# EAGLE design sch (EAGLE 7.3.0)
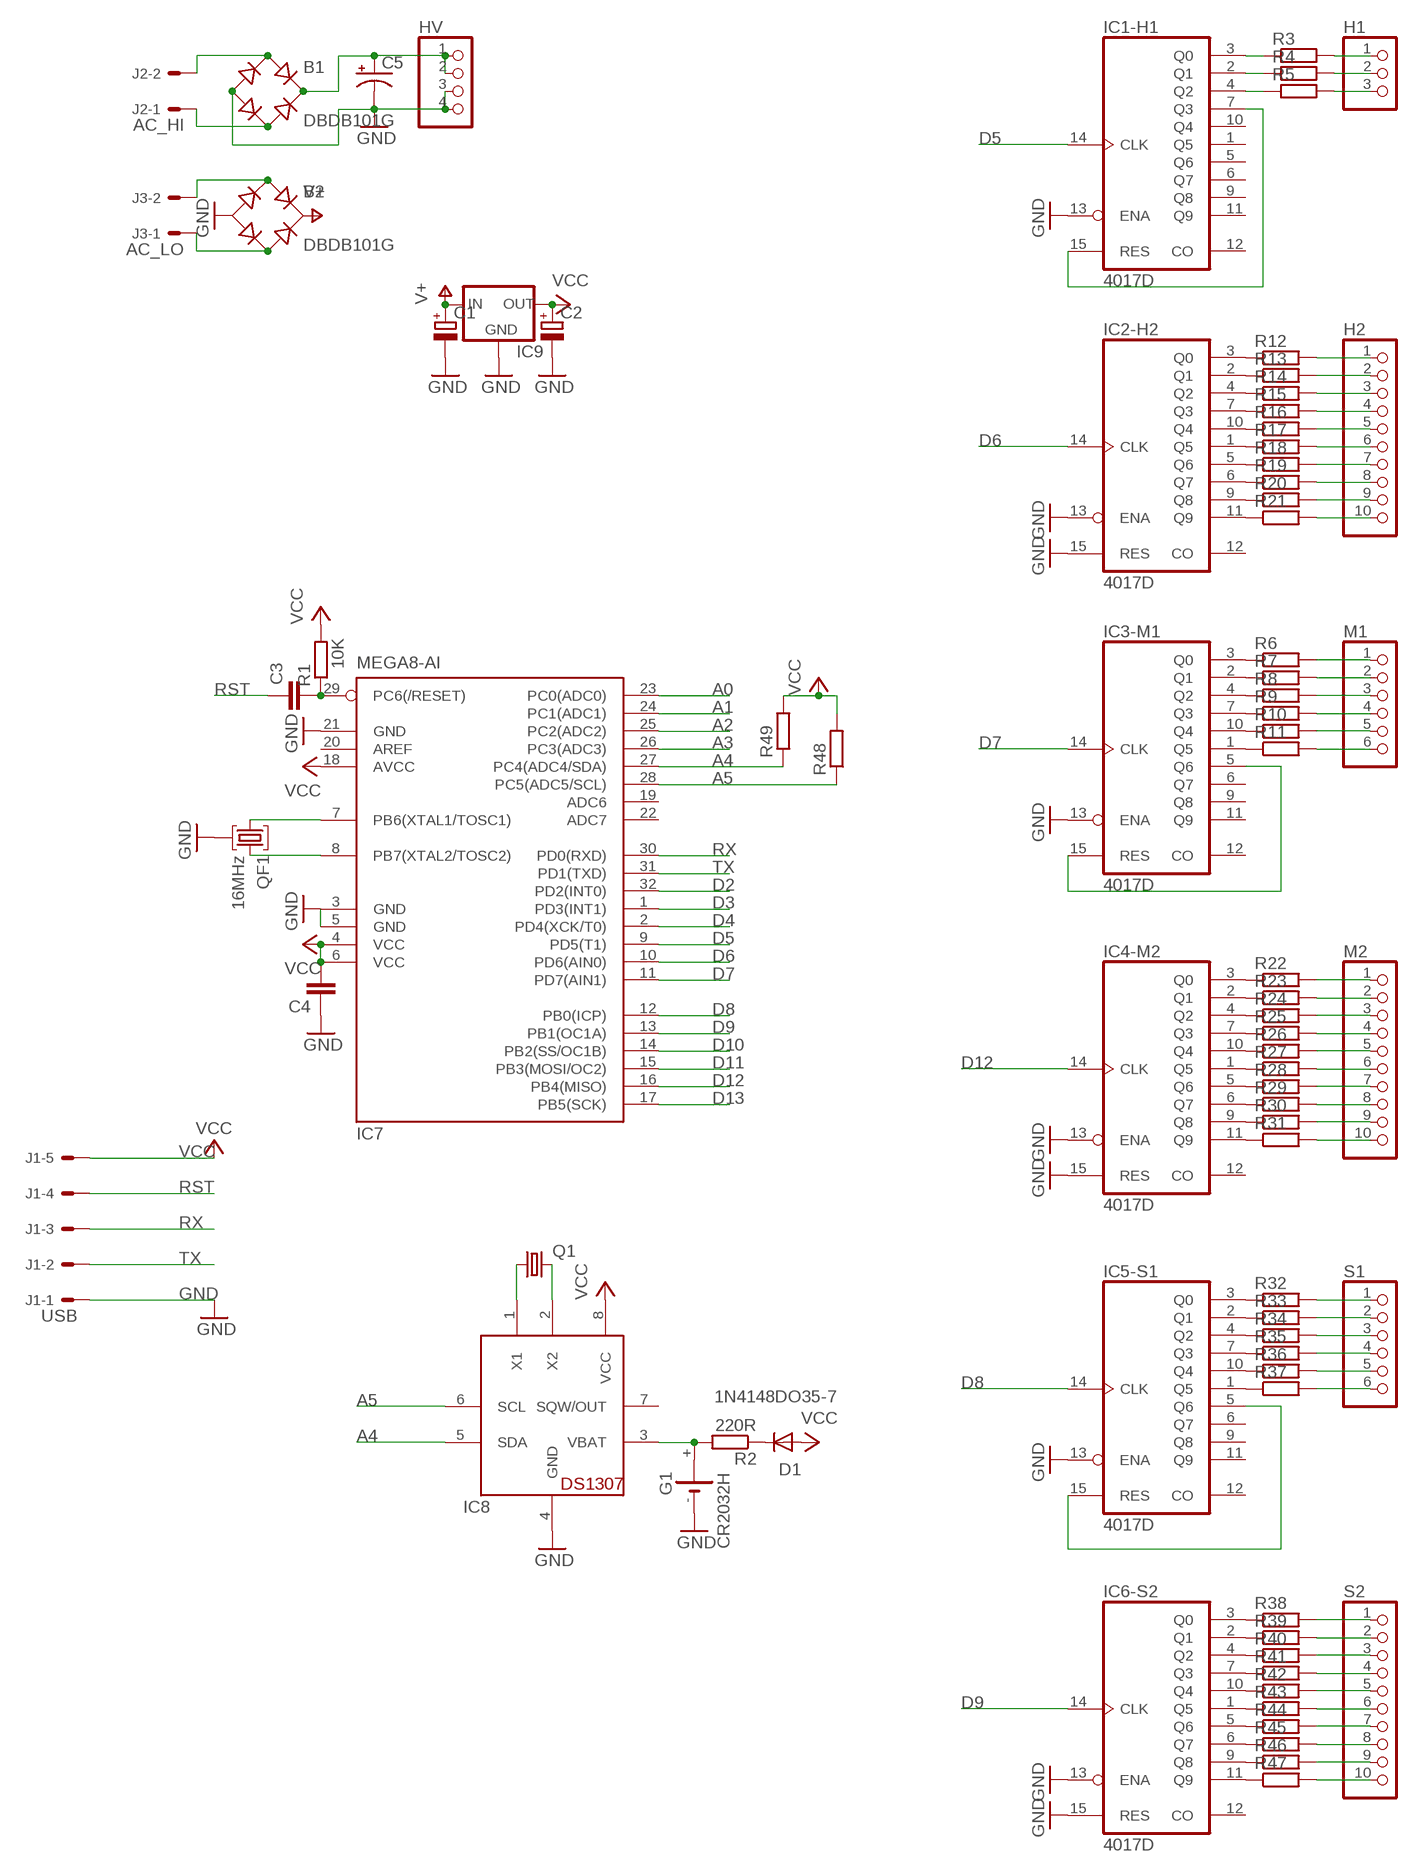
[diagram p0: schematic, sheet 1]

## Parts
B1  DBDB101G  [DB]
B2  DBDB101G  [DB]
C1  CPOL-EU140CLH-1010  [140CLH-1010]
C2  CPOL-EU140CLH-1010  [140CLH-1010]
C3  C-EUC1206K  [C1206K]
C4  C-EUC1206K  [C1206K]
C5  CPOL-USE5-13  [E5-13]
D1  1N4148DO35-7  [DO35-7]
G1  CR2032H  [CR2032H]
H1  PINHD-1X3  [1X03]
H2  PINHD-1X10  [1X10]
HV  PINHD-1X4  [1X04]
IC1-H1  4017D  [SO16]
IC2-H2  4017D  [SO16]
IC3-M1  4017D  [SO16]
IC4-M2  4017D  [SO16]
IC5-S1  4017D  [SO16]
IC6-S2  4017D  [SO16]
IC7  MEGA8-AI  [TQFP32-08]
IC8  DS1307  [DIL08]
IC9  78XXS  [78XXS]
J1  USB  22-05-7058-05  [7395-05]
J2  AC_HI  22-05-7028-02  [7395-02]
J3  AC_LO  22-05-7028-02  [7395-02]
M1  PINHD-1X6  [1X06]
M2  PINHD-1X10  [1X10]
Q1  CRYSTALTC26H  [TC26H]
QF1  16MHz  8M10AHC49T  [HC49U]
R1  10K  R-EU_0207/7  [0207/7]
R2  220R  R-EU_0207/7  [0207/7]
R3  R-EU_0204/5  [0204/5]
R4  R-EU_0204/5  [0204/5]
R5  R-EU_0204/5  [0204/5]
R6  R-EU_0204/5  [0204/5]
R7  R-EU_0204/5  [0204/5]
R8  R-EU_0204/5  [0204/5]
R9  R-EU_0204/5  [0204/5]
R10  R-EU_0204/5  [0204/5]
R11  R-EU_0204/5  [0204/5]
R12  R-EU_0204/5  [0204/5]
R13  R-EU_0204/5  [0204/5]
R14  R-EU_0204/5  [0204/5]
R15  R-EU_0204/5  [0204/5]
R16  R-EU_0204/5  [0204/5]
R17  R-EU_0204/5  [0204/5]
R18  R-EU_0204/5  [0204/5]
R19  R-EU_0204/5  [0204/5]
R20  R-EU_0204/5  [0204/5]
R21  R-EU_0204/5  [0204/5]
R22  R-EU_0204/5  [0204/5]
R23  R-EU_0204/5  [0204/5]
R24  R-EU_0204/5  [0204/5]
R25  R-EU_0204/5  [0204/5]
R26  R-EU_0204/5  [0204/5]
R27  R-EU_0204/5  [0204/5]
R28  R-EU_0204/5  [0204/5]
R29  R-EU_0204/5  [0204/5]
R30  R-EU_0204/5  [0204/5]
R31  R-EU_0204/5  [0204/5]
R32  R-EU_0204/5  [0204/5]
R33  R-EU_0204/5  [0204/5]
R34  R-EU_0204/5  [0204/5]
R35  R-EU_0204/5  [0204/5]
R36  R-EU_0204/5  [0204/5]
R37  R-EU_0204/5  [0204/5]
R38  R-EU_0204/5  [0204/5]
R39  R-EU_0204/5  [0204/5]
R40  R-EU_0204/5  [0204/5]
R41  R-EU_0204/5  [0204/5]
R42  R-EU_0204/5  [0204/5]
R43  R-EU_0204/5  [0204/5]
R44  R-EU_0204/5  [0204/5]
R45  R-EU_0204/5  [0204/5]
R46  R-EU_0204/5  [0204/5]
R47  R-EU_0204/5  [0204/5]
R48  R-EU_0204/5  [0204/5]
R49  R-EU_M1206  [M1206]
S1  PINHD-1X6  [1X06]
S2  PINHD-1X10  [1X10]

## Nets
A0: IC7.23(PC0(ADC0))
A1: IC7.24(PC1(ADC1))
A2: IC7.25(PC2(ADC2))
A3: IC7.26(PC3(ADC3))
A4: IC7.27(PC4(ADC4/SDA)) IC8.5(SDA) R49.1
A5: IC7.28(PC5(ADC5/SCL)) IC8.6(SCL) R48.1
D2: IC7.32(PD2(INT0))
D3: IC7.1(PD3(INT1))
D4: IC7.2(PD4(XCK/T0))
D5: IC1-H1.14(CLK) IC7.9(PD5(T1))
D6: IC2-H2.14(CLK) IC7.10(PD6(AIN0))
D7: IC3-M1.14(CLK) IC7.11(PD7(AIN1))
D8: IC5-S1.14(CLK) IC7.12(PB0(ICP))
D9: IC6-S2.14(CLK) IC7.13(PB1(OC1A))
D10: IC7.14(PB2(SS/OC1B))
D11: IC7.15(PB3(MOSI/OC2))
D12: IC4-M2.14(CLK) IC7.16(PB4(MISO))
D13: IC7.17(PB5(SCK))
GND: B1.- B2.- C1.- C2.- C4.1 C5.- G1.- HV.3 HV.4 IC1-H1.13(ENA) IC2-H2.13(ENA) IC2-H2.15(RES) IC3-M1.13(ENA) IC4-M2.13(ENA) IC4-M2.15(RES) IC5-S1.13(ENA) IC6-S2.13(ENA) IC6-S2.15(RES) IC7.3(GND) IC7.5(GND) IC7.21(GND) IC8.4(GND) IC9.GND J1.1 QF1.2
N$1: IC1-H1.3(Q0) R3.1
N$2: IC1-H1.2(Q1) R4.1
N$3: IC1-H1.7(Q3) IC1-H1.15(RES)
N$4: IC3-M1.3(Q0) R6.1
N$5: IC3-M1.2(Q1) R7.1
N$6: IC3-M1.4(Q2) R8.1
N$7: IC3-M1.7(Q3) R9.1
N$8: IC3-M1.10(Q4) R10.1
N$9: IC3-M1.1(Q5) R11.1
N$10: IC2-H2.3(Q0) R12.1
N$11: IC2-H2.2(Q1) R13.1
N$12: IC2-H2.4(Q2) R14.1
N$13: IC2-H2.7(Q3) R15.1
N$14: IC4-M2.3(Q0) R22.1
N$15: IC4-M2.2(Q1) R23.1
N$16: IC4-M2.4(Q2) R24.1
N$17: IC4-M2.7(Q3) R25.1
N$18: IC4-M2.10(Q4) R26.1
N$19: IC4-M2.1(Q5) R27.1
N$20: IC4-M2.5(Q6) R28.1
N$21: IC4-M2.6(Q7) R29.1
N$22: IC4-M2.9(Q8) R30.1
N$23: IC4-M2.11(Q9) R31.1
N$24: IC5-S1.3(Q0) R32.1
N$25: IC5-S1.2(Q1) R33.1
N$26: IC5-S1.4(Q2) R34.1
N$27: IC5-S1.7(Q3) R35.1
N$28: IC5-S1.10(Q4) R36.1
N$29: IC5-S1.5(Q6) IC5-S1.15(RES)
N$30: IC5-S1.1(Q5) R37.1
N$31: IC6-S2.3(Q0) R38.1
N$32: IC6-S2.2(Q1) R39.1
N$33: IC6-S2.4(Q2) R40.1
N$34: IC6-S2.7(Q3) R41.1
N$35: IC6-S2.10(Q4) R42.1
N$36: IC6-S2.1(Q5) R43.1
N$37: IC6-S2.5(Q6) R44.1
N$38: IC6-S2.6(Q7) R45.1
N$39: IC6-S2.9(Q8) R46.1
N$40: IC2-H2.10(Q4) R16.1
N$41: IC2-H2.1(Q5) R17.1
N$42: IC2-H2.5(Q6) R18.1
N$43: IC2-H2.6(Q7) R19.1
N$44: IC2-H2.9(Q8) R20.1
N$45: IC2-H2.11(Q9) R21.1
N$46: IC3-M1.5(Q6) IC3-M1.15(RES)
N$47: C3.2 IC7.29(PC6(/RESET)) R1.1
N$48: D1.C R2.1
N$49: B2.AC1 J3.2
N$50: B2.AC2 J3.1
N$51: IC7.7(PB6(XTAL1/TOSC1)) QF1.1
N$52: IC7.8(PB7(XTAL2/TOSC2)) QF1.3
N$53: IC8.1(X1) Q1.1
N$54: IC8.2(X2) Q1.2
N$55: G1.+ IC8.3(VBAT) R2.2
N$56: B1.AC2 J2.1
N$57: B1.AC1 J2.2
N$58: B1.+ C5.+ HV.1 HV.2
N$59: H1.1 R3.2
N$60: H1.2 R4.2
N$61: H1.3 R5.2
N$62: IC1-H1.4(Q2) R5.1
N$63: IC6-S2.11(Q9) R47.1
N$64: R47.2 S2.10
N$65: R46.2 S2.9
N$66: R45.2 S2.8
N$67: R44.2 S2.7
N$68: R43.2 S2.6
N$69: R42.2 S2.5
N$70: R41.2 S2.4
N$71: R40.2 S2.3
N$72: R39.2 S2.2
N$73: R38.2 S2.1
N$74: R32.2 S1.1
N$75: R33.2 S1.2
N$76: R34.2 S1.3
N$77: R35.2 S1.4
N$78: R36.2 S1.5
N$79: R37.2 S1.6
N$80: M2.10 R31.2
N$81: M2.9 R30.2
N$82: M2.8 R29.2
N$83: M2.7 R28.2
N$84: M2.6 R27.2
N$85: M2.5 R26.2
N$86: M2.4 R25.2
N$87: M2.3 R24.2
N$88: M2.2 R23.2
N$89: M2.1 R22.2
N$90: M1.6 R11.2
N$91: M1.5 R10.2
N$92: M1.4 R9.2
N$93: M1.3 R8.2
N$94: M1.2 R7.2
N$95: M1.1 R6.2
N$96: H2.10 R21.2
N$97: H2.9 R20.2
N$98: H2.8 R19.2
N$99: H2.7 R18.2
N$100: H2.6 R17.2
N$101: H2.5 R16.2
N$102: H2.4 R15.2
N$103: H2.1 R12.2
N$104: H2.2 R13.2
N$105: H2.3 R14.2
RST: C3.1 J1.4
RX: IC7.30(PD0(RXD)) J1.3
TX: IC7.31(PD1(TXD)) J1.2
V+: B2.+ C1.+ IC9.IN
VCC: C2.+ C4.2 D1.A IC7.4(VCC) IC7.6(VCC) IC7.18(AVCC) IC8.8(VCC) IC9.OUT J1.5 R1.2 R48.2 R49.2
Unconnected: G1.+@1(+) IC1-H1.1(Q5) IC1-H1.5(Q6) IC1-H1.6(Q7) IC1-H1.9(Q8) IC1-H1.10(Q4) IC1-H1.11(Q9) IC1-H1.12(CO) IC2-H2.12(CO) IC3-M1.6(Q7) IC3-M1.9(Q8) IC3-M1.11(Q9) IC3-M1.12(CO) IC4-M2.12(CO) IC5-S1.6(Q7) IC5-S1.9(Q8) IC5-S1.11(Q9) IC5-S1.12(CO) IC6-S2.12(CO) IC7.19(ADC6) IC7.20(AREF) IC7.22(ADC7) IC8.7(SQW/OUT)

## Power pins joined to a net without a drawn wire
VDD: IC1-H1.16(VDD) IC2-H2.16(VDD) IC3-M1.16(VDD) IC4-M2.16(VDD) IC5-S1.16(VDD) IC6-S2.16(VDD)
VSS: IC1-H1.8(VSS) IC2-H2.8(VSS) IC3-M1.8(VSS) IC4-M2.8(VSS) IC5-S1.8(VSS) IC6-S2.8(VSS)

## Library data of the parts
B1 B2 = rectifier:DB?*G: Single Phase 1.0 AMP Glass Passivated Bridge Rectifier Taiwan Semiconductor Co.,Ltd. - TSC Source: http://www.taiwansemi.com/TSCbig5/ezcatfiles/cust/img/img/db101g.pdf http://www.ts.com.tw/db/pictures/modules/PDT/PDT060207001/DBLS201G.pdf
C1 C2 = rcl:CPOL-EU: POLARIZED CAPACITOR, European symbol
C3 C4 = rcl:C-EU: CAPACITOR, European symbol
C5 = rcl:CPOL-US: POLARIZED CAPACITOR, American symbol
D1 = diode:1N4148: DIODE high speed (Philips)
G1 = battery:CR2032H: LI BATTERY Varta
H1 = pinhead:PINHD-1X3: PIN HEADER
H2 M2 S2 = pinhead:PINHD-1X10: PIN HEADER
HV = pinhead:PINHD-1X4: PIN HEADER
IC1-H1 IC2-H2 IC3-M1 IC4-M2 IC5-S1 IC6-S2 = 40xx:4017: COUNTER/DIVIDER
IC7 = atmel:MEGA8: MICROCONTROLLER 8 Kbytes FLASH, 1 kbytes SRAM, 512 bytes EEPROM, USART, 6-channel 10 bit ADC, 2-channel 8 bit ADC Pin compatible with Atmega48, ATMega88, ATMega168 Source: avr.lbr; MPN: ATMEGA8-16AU; OC_FARNELL: 9171371; OC_NEWARK: 73M8863
IC8 = adafruit:DS1307: DS1307 Real time clock (RTC) with battery backup ability. Talk to it via i2c
IC9 = v-reg:78XXS: VOLTAGE REGULATOR
J1 = con-molex:22-?-05: CONNECTOR wire to board 2.54 mm (.1 inch) pitch header; OC_FARNELL: unknown; OC_NEWARK: unknown
J2 J3 = con-molex:22-?-02: CONNECTOR wire to board 2.54 mm (.1 inch) pitch header; OC_FARNELL: 9731601; OC_NEWARK: unknown
M1 S1 = pinhead:PINHD-1X6: PIN HEADER
Q1 = crystal:CRYSTAL: CRYSTAL; OC_FARNELL: unknown; OC_NEWARK: unknown
QF1 = crystal:8M10AHC49T: Monolithic Crystal Filters Source: www.vanlong.com; OC_FARNELL: unknown; OC_NEWARK: unknown
R1-R49 = rcl:R-EU_: RESISTOR, European symbol

## Board
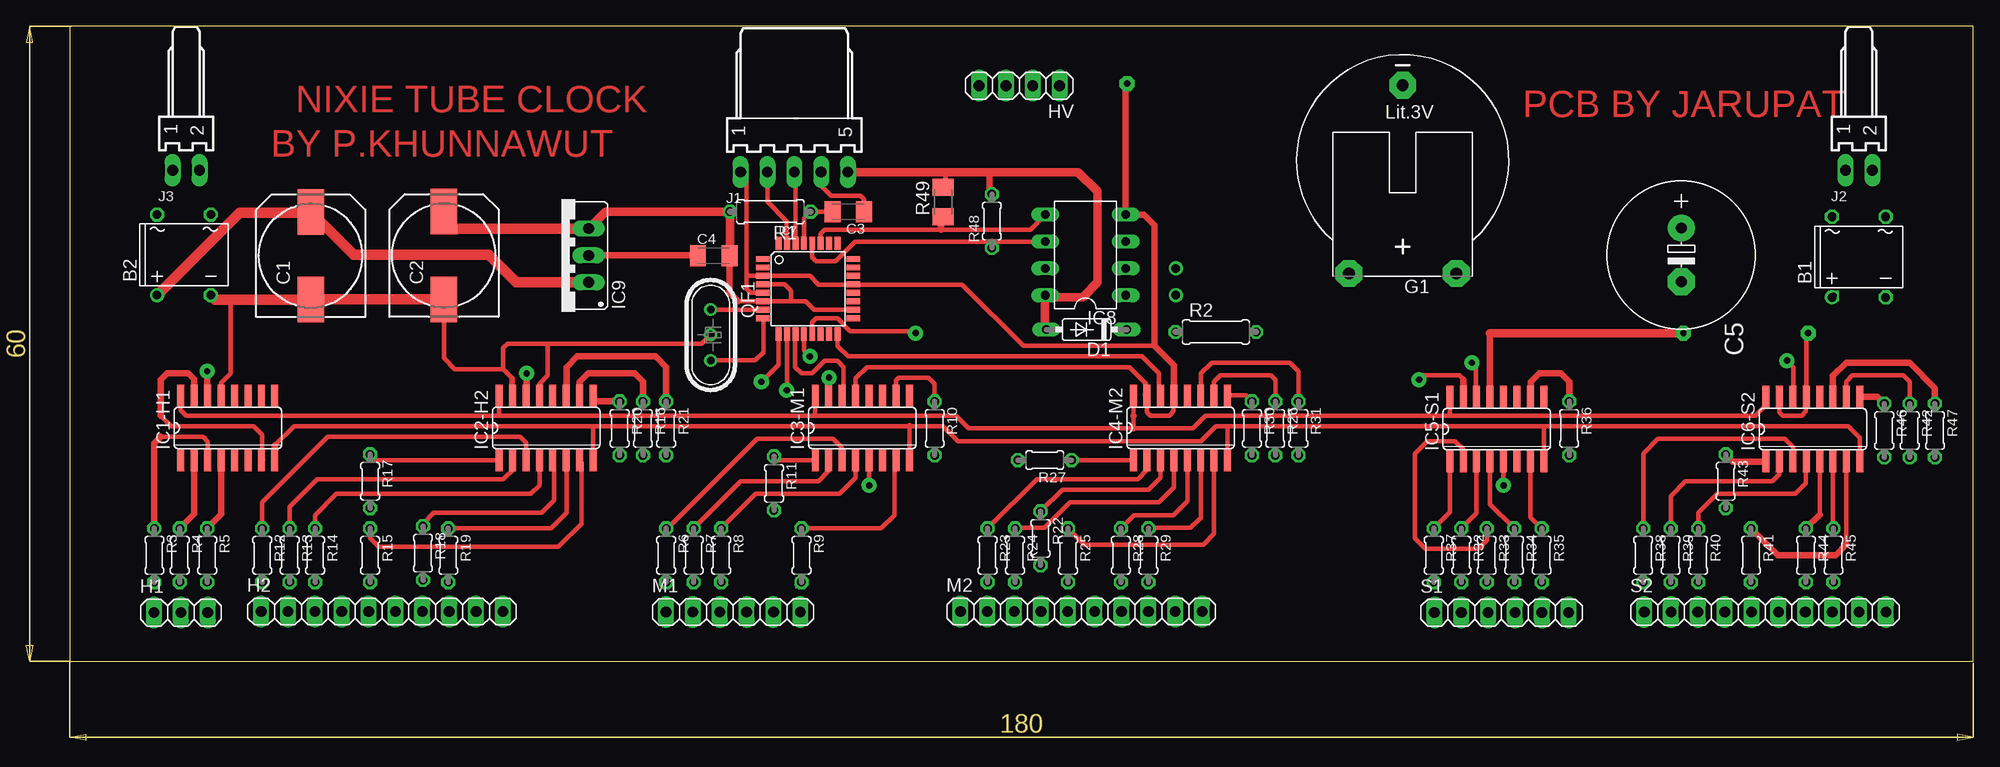
[diagram p1: board, top side]
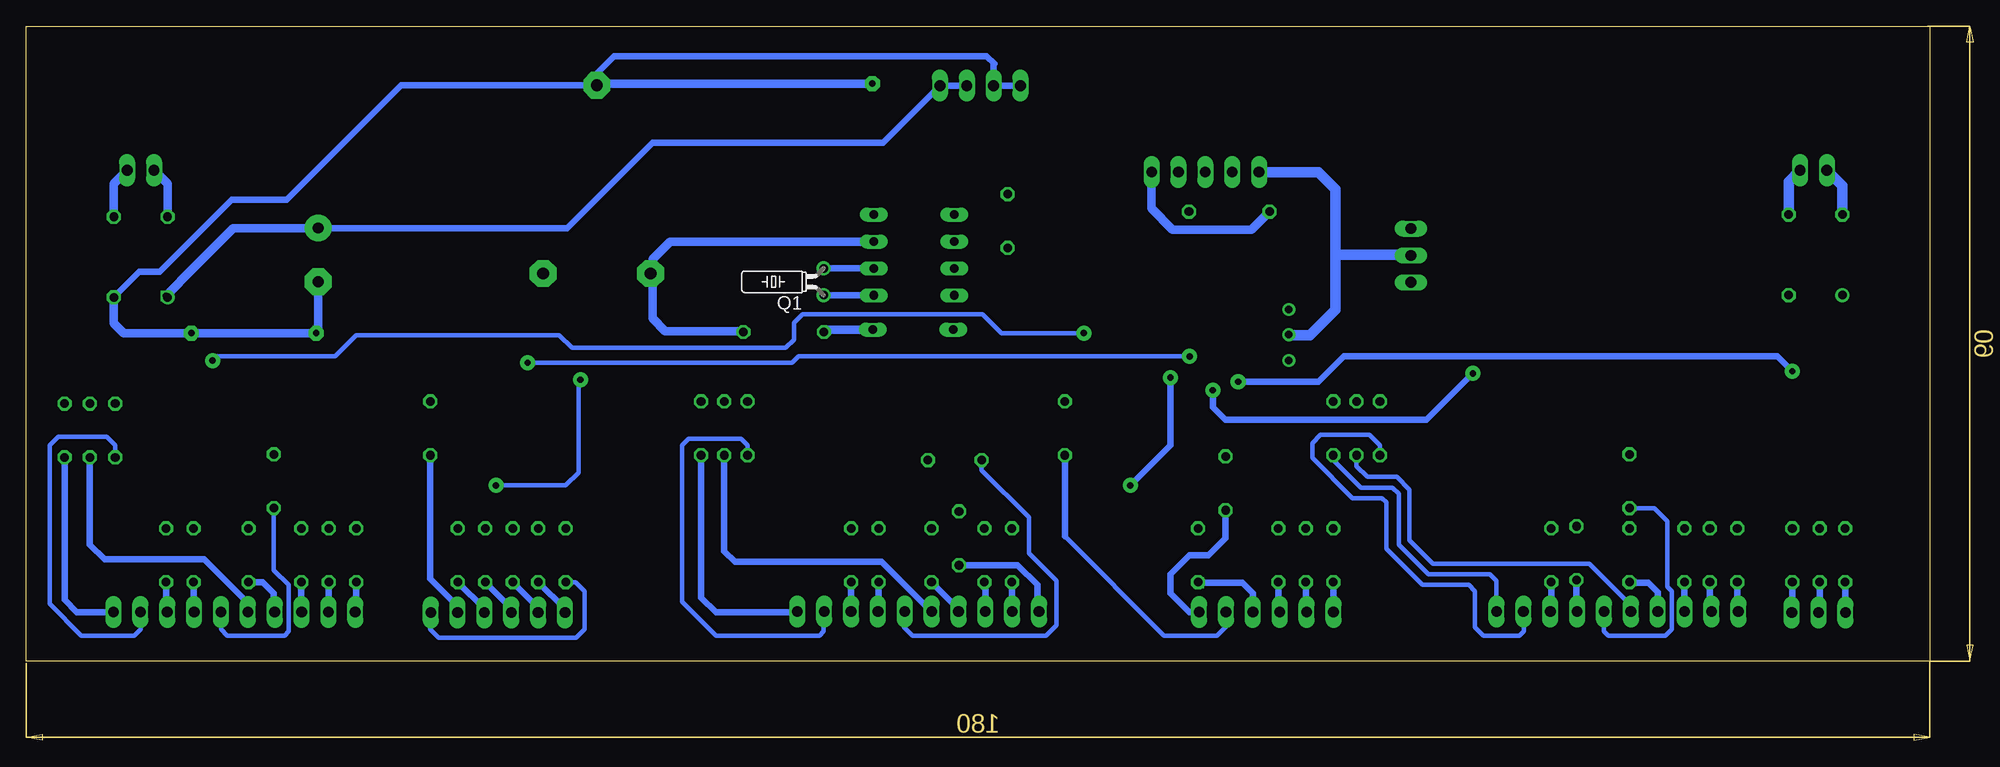
[diagram p2: board, bottom side, seen from below]

Size 180 x 60 mm. Coordinates in mm from the lower left corner, seen from the top.
Outline: 0,0 180,0 180,60 0,60 0,0
Copper layers (1*16): Top 0.035mm / dielectric 1.5mm / Bottom 0.035mm
Design rules "default": minimum track width 10mil, minimum drill 24mil, track to track 8mil, track to pad 8mil, pad to pad 8mil, via to via 8mil, smd to smd 8mil, copper to edge 40mil, drill to drill 8mil, minimum pad ring 10mil, minimum via ring 8mil, stop-mask expansion 4mil, vias tented up to drill 0mil, thermal gap 10mil

### Footprints (pad centres in the part's own frame; a part is rotated, then mirrored left to right if it is on the bottom)
DB = drill 0.813: + -2.54,-3.81 | drill 0.813 octagon: - 2.54,-3.81; AC1 2.54,3.81; AC2 -2.54,3.81
140CLH-1010 = smd 4.3 x 2.5: + 4.15,0; - -4.15,0
C1206K = smd 1.5 x 2: 1 -1.5,0; 2 1.5,0
E5-13 = drill 1.016 pad 2.54: + -2.54,0 | drill 1.016 pad 2.54 octagon: - 2.54,0
DO35-7 = drill 0.813 long: A 3.81,0; C -3.81,0
CR2032H = drill 1.118 pad 2.54 octagon: + 5.08,10.795; +@1 -5.08,10.795; - 0,-6.985
1X03 = drill 1.016 long: 1 -2.54,0; 2 0,0; 3 2.54,0
1X10 = drill 1.016 long: 1 -11.43,0; 2 -8.89,0; 3 -6.35,0; 4 -3.81,0; 5 -1.27,0; 6 1.27,0; 7 3.81,0; 8 6.35,0; 9 8.89,0; 10 11.43,0
1X04 = drill 1.016 long: 1 -3.81,0; 2 -1.27,0; 3 1.27,0; 4 3.81,0
SO16 = smd 0.66 x 2.032: 1 -4.445,-3.073; 2 -3.175,-3.073; 3 -1.905,-3.073; 4 -0.635,-3.073; 5 0.635,-3.073; 6 1.905,-3.073; 7 3.175,-3.073; 8 4.445,-3.073; 9 4.445,3.073; 10 3.175,3.073; 11 1.905,3.073; 12 0.635,3.073; 13 -0.635,3.073; 14 -1.905,3.073; 15 -3.175,3.073; 16 -4.445,3.073
TQFP32-08 = smd 1.27 x 0.559: 1 -4.293,2.8; 2 -4.293,2; 3 -4.293,1.2; 4 -4.293,0.4; 5 -4.293,-0.4; 6 -4.293,-1.2; 7 -4.293,-2; 8 -4.293,-2.8; 17 4.293,-2.8; 18 4.293,-2; 19 4.293,-1.2; 20 4.293,-0.4; 21 4.293,0.4; 22 4.293,1.2; 23 4.293,2; 24 4.293,2.8 | smd 0.559 x 1.27: 9 -2.8,-4.293; 10 -2,-4.293; 11 -1.2,-4.293; 12 -0.4,-4.293; 13 0.4,-4.293; 14 1.2,-4.293; 15 2,-4.293; 16 2.8,-4.293; 25 2.8,4.293; 26 2,4.293; 27 1.2,4.293; 28 0.4,4.293; 29 -0.4,4.293; 30 -1.2,4.293; 31 -2,4.293; 32 -2.8,4.293
DIL08 = drill 0.813 long: 1 -3.81,-3.81; 2 -1.27,-3.81; 3 1.27,-3.81; 4 3.81,-3.81; 5 3.81,3.81; 6 1.27,3.81; 7 -1.27,3.81; 8 -3.81,3.81
78XXS = drill 1.016 long: GND 0,-2.54; IN -2.54,-2.54; OUT 2.54,-2.54
7395-05 = drill 1.016 long: 1 5.08,0; 2 2.54,0; 3 0,0; 4 -2.54,0; 5 -5.08,0
7395-02 = drill 1.016 long: 1 1.27,0; 2 -1.27,0
1X06 = drill 1.016 long: 1 -6.35,0; 2 -3.81,0; 3 -1.27,0; 4 1.27,0; 5 3.81,0; 6 6.35,0
TC26H = drill 0.813: 1 -1.27,0; 2 1.27,0
HC49U = drill 0.7 pad 1.2: 1 -2.413,0; 2 -0.027,0; 3 2.413,0
0207/7 = drill 0.813 octagon: 1 -3.81,0; 2 3.81,0
0204/5 = drill 0.813 octagon: 1 -2.54,0; 2 2.54,0
M1206 = smd 1.6 x 2: 1 -1.4,0; 2 1.4,0

### Placement (x,y rotation side)
B1  169.2,38.2 0 top
B2  10.8,38.4 0 top
C1  22.79,38.32 90 top
C2  35.39,38.35 90 top
C3  73.63,42.49 180 top
C4  60.89,38.31 0 top
C5  152.4,38.4 270 top
D1  96.16,31.34 180 top
G1  126.06,47.44 180 top
H1  10.51,4.58 0 top
H2  29.53,4.68 0 top
HV  89.8,54.4 180 top
IC1-H1  14.95,22.04 0 top
IC2-H2  45.05,22.04 0 top
IC3-M1  74.95,22.04 0 top
IC4-M2  105.05,22.04 0 top
IC5-S1  134.95,21.93 0 top
IC6-S2  164.85,21.93 0 top
IC7  69.82,35.21 0 top
IC8  96.05,38.39 90 top
IC9  46.53,38.35 90 top
J1  68.51,46.23 180 top
J2  169.2,46.4 180 top
J3  11,46.4 180 top
M1  62.74,4.63 0 top
M2  95.66,4.68 0 top
Q1  104.6,35.86 90 bottom
QF1  60.61,30.83 270 top
R1  66.25,42.49 180 top
R2  108.39,31.11 0 top
R3  8,10 270 top
R4  10.4,10 270 top
R5  13,10 270 top
R6  56.4,10 270 top
R7  59,10 270 top
R8  61.6,10 270 top
R9  69.2,10 270 top
R10  81.8,22 270 top
R11  66.6,16.8 270 top
R12  18.2,10 270 top
R13  20.8,10 270 top
R14  23.2,10 270 top
R15  28.4,10 270 top
R16  54.2,22 270 top
R17  28.4,17 270 top
R18  33.4,10.2 270 top
R19  35.8,10 270 top
R20  52,22 270 top
R21  56.4,22 270 top
R22  91.8,11.6 270 top
R23  86.8,10 270 top
R24  89.4,10 270 top
R25  94.4,10 270 top
R26  114,22 270 top
R27  92.2,19 180 top
R28  99.4,10 270 top
R29  102,10 270 top
R30  111.8,22 270 top
R31  116.2,22 270 top
R32  131.6,10 270 top
R33  134,10 270 top
R34  136.6,10 270 top
R35  139.2,10 270 top
R36  141.8,22 270 top
R37  129,10 270 top
R38  148.8,10 270 top
R39  151.4,10 270 top
R40  154,10 270 top
R41  159,10 270 top
R42  174,21.8 270 top
R43  156.6,17 270 top
R44  164.2,10 270 top
R45  166.8,10 270 top
R46  171.6,21.8 270 top
R47  176.4,21.8 270 top
R48  87.2,41.6 90 top
R49  82.6,43.4 90 top
S1  135.41,4.58 0 top
S2  160.33,4.63 0 top

### Tracks (layer width: path | path; a pad name or v marks a point on that pad's centre or on a via)
A4
  Top 0.406: IC7.27 71.02,40.42 71.4,40.8 82.4,40.8 90.84,40.8 IC8.5
  Top 0.61: R49.1 82.4,42 82.4,40.8
A5
  Top 0.406: IC8.6 87.2,39.66 74.26,39.66 72.4,37.8 70.6,37.8 70.2,38.2 70.2,39.48 IC7.28
  Top 0.61: R48.1 87.2,39.66
D5  (via drill 0.6 pad 1.42)
  Top 0.406: v65.4,26.4 67.02,28.02 IC7.9
  Top 0.61: IC1-H1.14 13,25.16 v13,27.4
  Bottom 0.61: v13,27.4 14.4,28.8 55.4,28.8 57.8,26.4 v65.4,26.4
D6  (via drill 0.6 pad 1.42)
  Top 0.406: 67.82,25.62 IC7.10
  Top 0.61: IC2-H2.14 43.2,25.17 v43.2,27.2 | v67.8,25.6 67.82,25.62
  Bottom 0.61: v43.2,27.2 47.6,22.8 66.6,22.8 67.8,24 v67.8,25.6
D7
  Top 0.406: IC7.11 68.6,30.92 68.6,27.8 69.2,27.2 70.2,27.2 71.4,28.4 72.6,28.4 73.2,27.8 73.2,25.27 IC3-M1.14
D8  (via drill 0.6 pad 1.42)
  Top 0.406: IC7.12 69.42,29.38 v70,28.8 | IC5-S1.14 133,25.05 133,27.8 v132.6,28.2
  Bottom 0.406: v70,28.8 107,28.8 107.6,28.2 v132.6,28.2
D9  (via drill 0.6 pad 1.42)
  Top 0.406: IC6-S2.14 163,25.06 163,27.8 v162.4,28.4 | IC7.13 70.22,32.02 70.6,32.4 72.6,32.4 73.8,31.2 79.8,31.2 v80,31
  Bottom 0.406: v162.4,28.4 162,28.8 150.8,28.8 148.8,30.8 129.6,30.8 128.4,29.6 108.2,29.6 107.4,30.4 107.4,32 106.6,32.8 89.6,32.8 87.8,31 v80,31
D12
  Top 0.406: IC7.16 72.62,29.78 73.6,28.8 101.4,28.8 103,27.2 103,25.26 IC4-M2.14
GND  (via drill 0.6 pad 1.42)
  Top 0.406: IC6-S2.15 161.68,23.52 162,23.2 163.8,23.2 164.2,23.6 164.2,24.99 | IC6-S2.13 164.22,30.82 | IC7.21 70.8,35.6 69.99,36.41 IC7.3 64.19,36.41 64,36.6 | IC7.21 | 64,36.6 64,35.2 64.39,34.81 IC7.5 | 64,45.6 64,45.66 J1.1 | 64,36.6 64,45.6 | 64,45.6 63.4,46.2 | IC3-M1.13 74.31,26.71 75.4,27.8 100.2,27.8 101.8,26.2 101.8,25.19 | IC4-M2.15 101.88,23.52 102.2,23.2 104,23.2 104.4,23.6 104.4,25.1 | C2.- 35.39,28.61 36.4,27.6 41,27.6 | 41,27.6 41.8,26.8 | 41.8,26.8 41.8,25.19 IC2-H2.15 41.88,26.73 41.8,26.8 | IC2-H2.13 44.41,26.21 45.2,27 45.2,29.8 45,30 | 45,30 41.4,30 41,29.6 41,27.6 | 45,30 59.75,30 QF1.2 | IC1-H1.13 14.31,26.32 15.2,27.2 15.2,34.17 | IC7.21 84.4,35.6 90.2,29.8 102.6,29.8
  Top 0.61: 164.2,24.99 IC6-S2.13 | C1.- 22.82,34.2 | IC5-S1.13 134.31,31 | 164.22,30.82 v164.4,31 | v100,54.6 99.86,54.46 IC8.4 101.6,42.2 102.6,41.2 102.6,29.8 104.42,27.98 IC4-M2.13 104.4,25.1 | C4.1 59.35,38.35 IC9.GND | 101.8,25.19 IC4-M2.15
  Top 0.813: v152.6,31 134.31,31
  Top 1.016: B2.- 13.76,34.17 15.2,34.17 C1.- | 22.82,34.2 C2.-
  Bottom 0.61: 152.4,31.2 v152.6,31 | 63.4,46.2 J1.1 | QF1.2 60.55,30.8 | IC9.GND 49.07,38.4 | B1.- 169.33,36.8 167.4,36.8 160.6,43.6 155.4,43.6 144.57,54.42 G1.- 126.2,54.56 126.2,55.4 124.4,57.2 89.2,57.2 88.47,56.47 88.53,56.41 HV.3 HV.4
  Bottom 0.813: B1.- 171.74,31.94 170.8,31 v164.4,31 v152.6,31 | C5.- 152.4,31.2 | v100,54.6 125.89,54.6 G1.-
  Bottom 1.016: 63.4,46.2 57.8,46.2 56.2,44.6 56.2,38.4 | 60.55,30.8 58.6,30.8 56.2,33.2 56.2,38.4 | 49.07,38.4 56.2,38.4
N$1
  Top 0.406: IC1-H1.3 13.04,20.75 12.6,21.2 8.6,21.2
  Top 0.61: 8.6,21.2 8,20.6 R3.1
N$2
  Top 0.61: IC1-H1.2 11.78,13.91 R4.1
N$3
  Top 0.406: 8.6,23.2 9.6,22.2 17.4,22.2 18.2,21.4 18.2,19.04
  Top 0.61: IC1-H1.15 11.78,26.62 11.2,27.2 9.2,27.2 8.6,26.6 8.6,23.2 | 18.2,19.04 IC1-H1.7
N$4
  Top 0.406: 56.54,12.54 65,21 72.2,21 73,20.2 73,19.01
  Top 0.61: R6.1 56.54,12.54 | 73,19.01 IC3-M1.3
N$5
  Top 0.406: R7.1 63.46,17 70.8,17 71.78,17.98 IC3-M1.2
N$6
  Top 0.406: R8.1 64.86,15.8 72.8,15.8 74.31,17.32 IC3-M1.4
N$7
  Top 0.406: R9.1 76.74,12.54 78,13.8 78,18.84 IC3-M1.7
N$8
  Top 0.406: IC3-M1.10 78.12,26.52 78.4,26.8 81.2,26.8 81.8,26.2 R10.1
N$9
  Top 0.406: R11.1 66.97,18.97 IC3-M1.1
N$10
  Top 0.406: IC2-H2.3 43.15,20.66 42.6,21.2 24.4,21.2 18.2,15 R12.1
N$11
  Top 0.406: R13.1 20.8,14.6 23.4,17.2 41,17.2 42,18.2 42,18.84 IC2-H2.2
N$12
  Top 0.406: IC2-H2.4 44.41,16.61 43.6,15.8 25.2,15.8 23.2,13.8 R14.1
N$13
  Top 0.406: R15.1 28.4,11.6 29.2,10.8 46.2,10.8 48.4,13 48.4,18.79 IC2-H2.7
N$14
  Top 0.406: R22.1 93.86,16.2 102,16.2 103.14,17.34 IC4-M2.3
N$15
  Top 0.406: R23.1 91.46,17.2 101,17.2 101.88,18.07 IC4-M2.2
N$16
  Top 0.406: IC4-M2.4 104.42,16.41 103,15 94.6,15 92.2,12.6 89.46,12.6
  Top 0.61: 89.46,12.6 R24.1
N$17
  Top 0.406: R25.1 95.94,11 107.2,11 108.22,12.03 IC4-M2.7
N$18
  Top 0.406: R26.1 114,26.6 113.6,27 108.8,27 108.2,26.4 108.2,25.14
  Top 0.61: 108.2,25.14 IC4-M2.10
N$19
  Top 0.406: R27.1 100.57,19
  Top 0.61: 100.57,19 IC4-M2.1
N$20
  Top 0.406: R28.1 100.66,13.8 104.4,13.8 105.69,15.09 IC4-M2.5
N$21
  Top 0.406: IC4-M2.6 106.95,13.55 106,12.6 102.06,12.6
  Top 0.61: 102.06,12.6 R29.1
N$22
  Top 0.406: R30.1 111.23,25.11 IC4-M2.9
N$23
  Top 0.406: R31.1 116.2,27.4 115.4,28.2 108,28.2 107,27.2 107,25.16
  Top 0.61: 107,25.16 IC4-M2.11
N$24
  Top 0.406: IC5-S1.3 133.04,13.98 R32.1
N$25
  Top 0.406: R33.1 134,11.4 133.2,10.6 128.2,10.6 127.2,11.6 127.2,19.6 128.4,20.8 131,20.8 131.8,20 131.8,18.88
  Top 0.61: 131.8,18.88 IC5-S1.2
N$26
  Top 0.406: IC5-S1.4 134.31,14.82 R34.1
N$27
  Top 0.406: IC5-S1.7 138.12,13.62 R35.1
N$28
  Top 0.61: R36.1 141.8,26.4 141,27.2 139,27.2 138.2,26.4 138.2,25.08 IC5-S1.10
N$29  (via drill 0.6 pad 1.42)
  Top 0.406: v135.6,16.6 135.6,18.84 IC5-S1.5 | 131.78,26.57 131.78,26.62 131.4,27 128,27 v127.6,26.6
  Top 0.61: IC5-S1.15 131.78,26.57
  Bottom 0.406: v135.6,16.6 129,16.6 127.8,17.8 127.8,26.4 v127.6,26.6
N$30
  Top 0.406: IC5-S1.1 130.5,14.04 R37.1
N$31
  Top 0.406: R38.1 148.8,19.6 150.2,21 162.2,21 163,20.2 163,18.91
  Top 0.61: 163,18.91 IC6-S2.3
N$32
  Top 0.406: IC6-S2.2 161.68,17.68 161,17 152.8,17 151.4,15.6 R39.1
N$33
  Top 0.406: R40.1 154,14 155.8,15.8 163.2,15.8 164.2,16.8 164.2,18.84
  Top 0.61: 164.2,18.84 IC6-S2.4
N$34
  Top 0.406: IC6-S2.7 168.03,11.03
  Top 0.61: 168.03,11.03 167,10 161.54,10 R41.1
N$35
  Top 0.406: IC6-S2.10 168.03,26.43 168.6,27 173.4,27 174,26.4 R42.1
N$36
  Top 0.61: R43.1 157.28,18.86 IC6-S2.1
N$37
  Top 0.406: IC6-S2.5 165.49,13.82
  Top 0.61: 165.49,13.82 R44.1
N$38
  Top 0.406: IC6-S2.6 166.75,12.59
  Top 0.61: 166.75,12.59 R45.1
N$39
  Top 0.61: IC6-S2.9 170.94,25 R46.1
N$40
  Top 0.61: R16.1 54.2,26.4 53.4,27.2 49,27.2 48.2,26.4 48.2,25.14 IC2-H2.10
N$41
  Top 0.406: R17.1 28.97,18.97 IC2-H2.1
N$42
  Top 0.406: 33.4,13 34.4,14 44.6,14 45.8,15.2 45.8,18.85 IC2-H2.5
  Top 0.61: R18.1 33.4,13
N$43
  Top 0.406: R19.1 45.54,12.54 47,14 47,18.92
  Top 0.61: 47,18.92 IC2-H2.6
N$44
  Top 0.61: R20.1 49.74,24.54 49.6,24.4 49.6,25.01 IC2-H2.9
N$45
  Top 0.61: R21.1 56.4,27.8 55.4,28.8 48,28.8 47,27.8 47,25.16 IC2-H2.11
N$46  (via drill 0.6 pad 1.42)
  Top 0.406: 71.78,26.77 v71.8,26.8 | v75.6,16.6 75.6,18.95 IC3-M1.5
  Top 0.61: IC3-M1.15 71.78,26.77
  Bottom 0.61: v71.8,26.8 71.8,20.4 v75.6,16.6
N$47
  Top 0.406: IC7.29 69.42,41.85 R1.1 C3.2
N$48
  Bottom 0.61: 104.55,31.34 R2.1
  Bottom 0.813: D1.C 104.55,31.34
N$49
  Bottom 1.016: J3.2 13.34,45.33 B2.AC1
N$50
  Bottom 1.016: J3.1 8.26,44.93 B2.AC2
N$51
  Top 0.406: IC7.7 60.64,33.21 QF1.1
N$52
  Top 0.406: QF1.3 64.82,28.42 65.6,29.2 65.6,32.34 IC7.8
N$53
  Bottom 0.61: IC8.1 Q1.1
N$54
  Bottom 0.61: Q1.2 IC8.2
N$55
  Bottom 0.61: 112.49,31.2 R2.2 | 120.8,36.47 G1.+ 120.8,36.83 120.8,38
  Bottom 0.813: IC8.3 119.14,39.66 120.8,38 | 112.49,31.2 119.6,31.2 120.8,32.4 120.8,36.47
N$56
  Bottom 0.813: J2.1 166.66,45.13 B1.AC2
N$57
  Bottom 0.813: J2.2 171.74,45.13 B1.AC1
N$58  (via drill 0.6)
  Top 0.61: v166.8,34.53 B1.+
  Bottom 0.61: HV.2 HV.1 99.01,49 120.8,49 128.86,40.94 C5.+
  Bottom 0.813: C5.+ 160.46,40.94 164.2,37.2 v166.8,34.53
N$59
  Bottom 0.61: R3.2 8,4.61 H1.1
N$60
  Bottom 0.61: R4.2 10.4,4.69 H1.2
N$61
  Bottom 0.61: R5.2 13,4.63 H1.3
N$62
  Top 0.61: IC1-H1.4 14.31,13.86 R5.1
N$63
  Top 0.61: IC6-S2.11 166.75,26.95 168,28.2 174,28.2 176.4,25.8 R47.1
N$64
  Bottom 0.61: S2.10 175.23,4.63 176.4,5.8 R47.2
N$65
  Bottom 0.406: R46.2 171.6,20.4 172.4,21.2 177,21.2 177.8,20.4 177.8,5.4 174.8,2.4 169.8,2.4 169.2,3 169.2,4.61 S2.9
N$66
  Bottom 0.61: R45.2 166.8,4.75 S2.8
N$67
  Bottom 0.61: R44.2 164.2,4.69 S2.7
N$68
  Bottom 0.406: R43.2 156.6,8.6 155.2,7.2 155.2,2.8 155.6,2.4 161,2.4 161.6,3 S2.6
N$69
  Bottom 0.61: S2.5 159,4.69 159,5.4 163.2,9.6 172.6,9.6 174,11 R42.2
N$70
  Bottom 0.61: R41.2 157.66,7.46 156.6,6.4 156.6,4.71 S2.4
N$71
  Bottom 0.61: R40.2 154,4.65 S2.3
N$72
  Bottom 0.61: R39.2 151.4,4.67 S2.2
N$73
  Bottom 0.61: R38.2 148.8,4.73 S2.1
N$74
  Bottom 0.61: S1.1 129.06,4.92 R32.2
N$75
  Bottom 0.61: S1.2 131.6,5.06 R33.2
N$76
  Bottom 0.61: S1.3 134.14,5 R34.2
N$77
  Bottom 0.61: S1.4 136.68,4.94 R35.2
N$78
  Bottom 0.61: S1.5 139.2,4.6 139.2,5.2 141.8,7.8 R36.2
N$79
  Bottom 0.406: R37.2 128.06,7.46 127.2,6.6 127.2,3 128,2.2 141,2.2 141.8,3 141.8,4.54 S1.6
N$80
  Bottom 0.61: R31.2 116.2,6 114.8,4.6 107.17,4.6 M2.10
N$81
  Bottom 0.406: R30.2 111.8,20.4 112.4,21 117.4,21 118,20.4 118,5.6 114.8,2.4 105,2.4 104.6,2.8 104.6,4.63 M2.9
N$82
  Bottom 0.61: R29.2 M2.8
N$83
  Bottom 0.61: R28.2 99.4,4.75 M2.7
N$84
  Bottom 0.406: R27.2 89.66,18.06 85.2,13.6 85.2,10.2 82.6,7.6 82.6,3.4 83.6,2.4 96.2,2.4 97,3.2 97,4.61 M2.6
N$85
  Bottom 0.61: M2.5 99.11,9.4 113,9.4 114,10.4 R26.2
N$86
  Bottom 0.61: R25.2 91.85,4.91 M2.4
N$87
  Bottom 0.61: R24.2 89.31,7.37 M2.3
N$88
  Bottom 0.61: R23.2 86.77,7.43 M2.2
N$89
  Bottom 0.61: R22.2 86.26,9.06 84.4,7.2 84.4,4.85 M2.1
N$90  (via drill 0.6)
  Top 0.61: v69.12,4.6 M1.6
  Bottom 0.61: R11.2 66.6,11.6 68.2,10 70,10 71.8,8.2 71.8,6.4 70,4.6 v69.12,4.6
N$91
  Bottom 0.406: M1.5 66.55,3.25 67.4,2.4 72.4,2.4 81.8,11.8
  Bottom 0.61: 81.8,11.8 R10.2
N$92  (via drill 0.6)
  Top 0.61: v69.14,7.4 R9.2
  Bottom 0.61: M1.4 64.01,6.41 65,7.4 v69.14,7.4
N$93
  Bottom 0.61: R8.2 61.6,4.76 M1.3
N$94
  Bottom 0.61: R7.2 59,4.7 M1.2
N$95
  Bottom 0.61: R6.2 M1.1
N$96
  Bottom 0.406: R21.2 56.4,19 53.8,16.4 50.8,16.4 50.2,15.8 50.2,11 47.4,8.2 41.6,8.2 41,7.6 41,4.72 H2.10
N$97
  Bottom 0.406: R20.2 52,20.4 53,21.4 57.6,21.4 58.4,20.6 58.4,19.2 54.6,15.4 51.8,15.4 51.4,15 51.4,10.6 48,7.2 43.6,7.2 43,6.6 43,3.2 42.2,2.4 38.8,2.4 38.4,2.8 38.4,4.66 H2.9
N$98
  Bottom 0.61: R19.2 35.8,4.76 H2.8
N$99
  Bottom 0.61: R18.2 33.4,4.74 H2.7
N$100
  Bottom 0.406: R17.2 26.06,14.46 24.8,13.2 24.8,7 24.4,6.6 24.4,3 25,2.4 30.4,2.4 30.8,2.8 H2.6
N$101
  Bottom 0.406: H2.5 28.26,5.26 32.2,9.2 47,9.2 49.2,11.4 49.2,16.2 50.4,17.4 53.2,17.4 54.2,18.4 R16.2
N$102
  Bottom 0.61: H2.4 25.72,6.52 26.6,7.4 28.34,7.4 R15.2
N$103
  Bottom 0.61: R12.2 18.2,4.78 H2.1
N$104
  Bottom 0.61: R13.2 20.8,4.84 H2.2
N$105
  Bottom 0.61: R14.2 23.2,4.7 H2.3
RST
  Top 0.406: C3.1 75.13,43.67 74.8,44 72,44 71,45 71,46.18 J1.4
RX
  Top 0.406: IC7.30 68.62,46.12 J1.3
TX
  Top 0.406: J1.2 65.97,43.43 67.8,41.6 67.8,39.52 IC7.31
V+
  Top 0.61: C1.+ 22.86,42.4 23.4,42.4
  Top 1.016: B2.+ 16.07,42.4 22.86,42.4 | IC9.IN 42.19,35.81 39.6,38.4 26.86,38.4 C1.+
VCC
  Top 0.406: 92.23,33.21 92.24,33.2 | 68.2,34.01 69.59,34.01 70.4,33.2 IC7.18 | IC7.4 67.59,35.61 68.2,35 68.2,34.01 | 63.2,34 65.52,34 IC7.6 68.2,34.01 | R49.2 82.8,44.8 82.8,46.23
  Top 0.61: 92.24,31.25 D1.A | 92.42,34.4 IC8.8 | C2.+ 35.4,40.89 | 62.44,38.36 C4.2 62.39,34.81 63.2,34 | IC9.OUT 49.07,40.8 | R48.2 87,44.14 87,46.23
  Top 0.813: IC8.8 92.24,33.2 92.24,31.25 | 92.42,34.4 95.8,34.4 97.2,35.8 97.2,44.4 95.37,46.23 87,46.23 82.8,46.23 J1.5 | 62.44,38.36 R1.2 50.67,42.49 IC9.OUT
  Top 1.016: 35.4,40.89 IC9.OUT
  Bottom 0.813: J1.5 73.59,42.79 71.6,40.8 64.13,40.8 R1.2 | 49.16,40.8 IC9.OUT
VDD
  Top 0.406: IC1-H1.16 10.51,23.7 11,23.2 40.4,23.2 | 40.4,23.2 70.4,23.2 | 130.6,23.2 159.4,23.2 160.4,24.2 | IC5-S1.16 130.5,23.3 130.6,23.2 | IC3-M1.16 70.5,23.3 70.4,23.2 | IC2-H2.16 40.6,23.41 40.4,23.2 | 70.4,23.2 83.8,23.2 85,22 100.6,22 106.2,22 107.4,23.2 130.6,23.2 | IC4-M2.16 100.61,23.2 100.61,22
  Top 0.61: 160.4,24.2 IC6-S2.16 | 100.61,23.2 100.6,23.2 | 100.61,22 100.6,22
VSS
  Top 0.406: 19.39,20.39 21.2,22.2 49.4,22.2 | 49.4,22.2 79.4,22.2 82.6,22.2 84,20.8 107,20.8 108.4,22.2 109.4,22.2 | IC4-M2.8 109.5,22.11 109.4,22.2 | IC3-M1.8 79.39,22.2 | IC2-H2.8 49.49,22.11 49.4,22.2 | 109.4,22.2 139.4,22.2 | 139.4,22.2 168.2,22.2 169.29,21.11 IC6-S2.8 | IC5-S1.8 139.4,22.2
  Top 0.61: IC1-H1.8 19.39,20.39 | IC5-S1.8 | 79.39,22.2 79.4,22.2

### Text on the board
Top: NIXIE TUBE CLOCK | PCB BY JARUPAT | BY P.KHUNNAWUT
tValues: Fix con : H1, H2, M1, M2, S1, S2,HV